# EAGLE schematic Mac_Project_sch_With_Resistors (EAGLE 9.1.3)
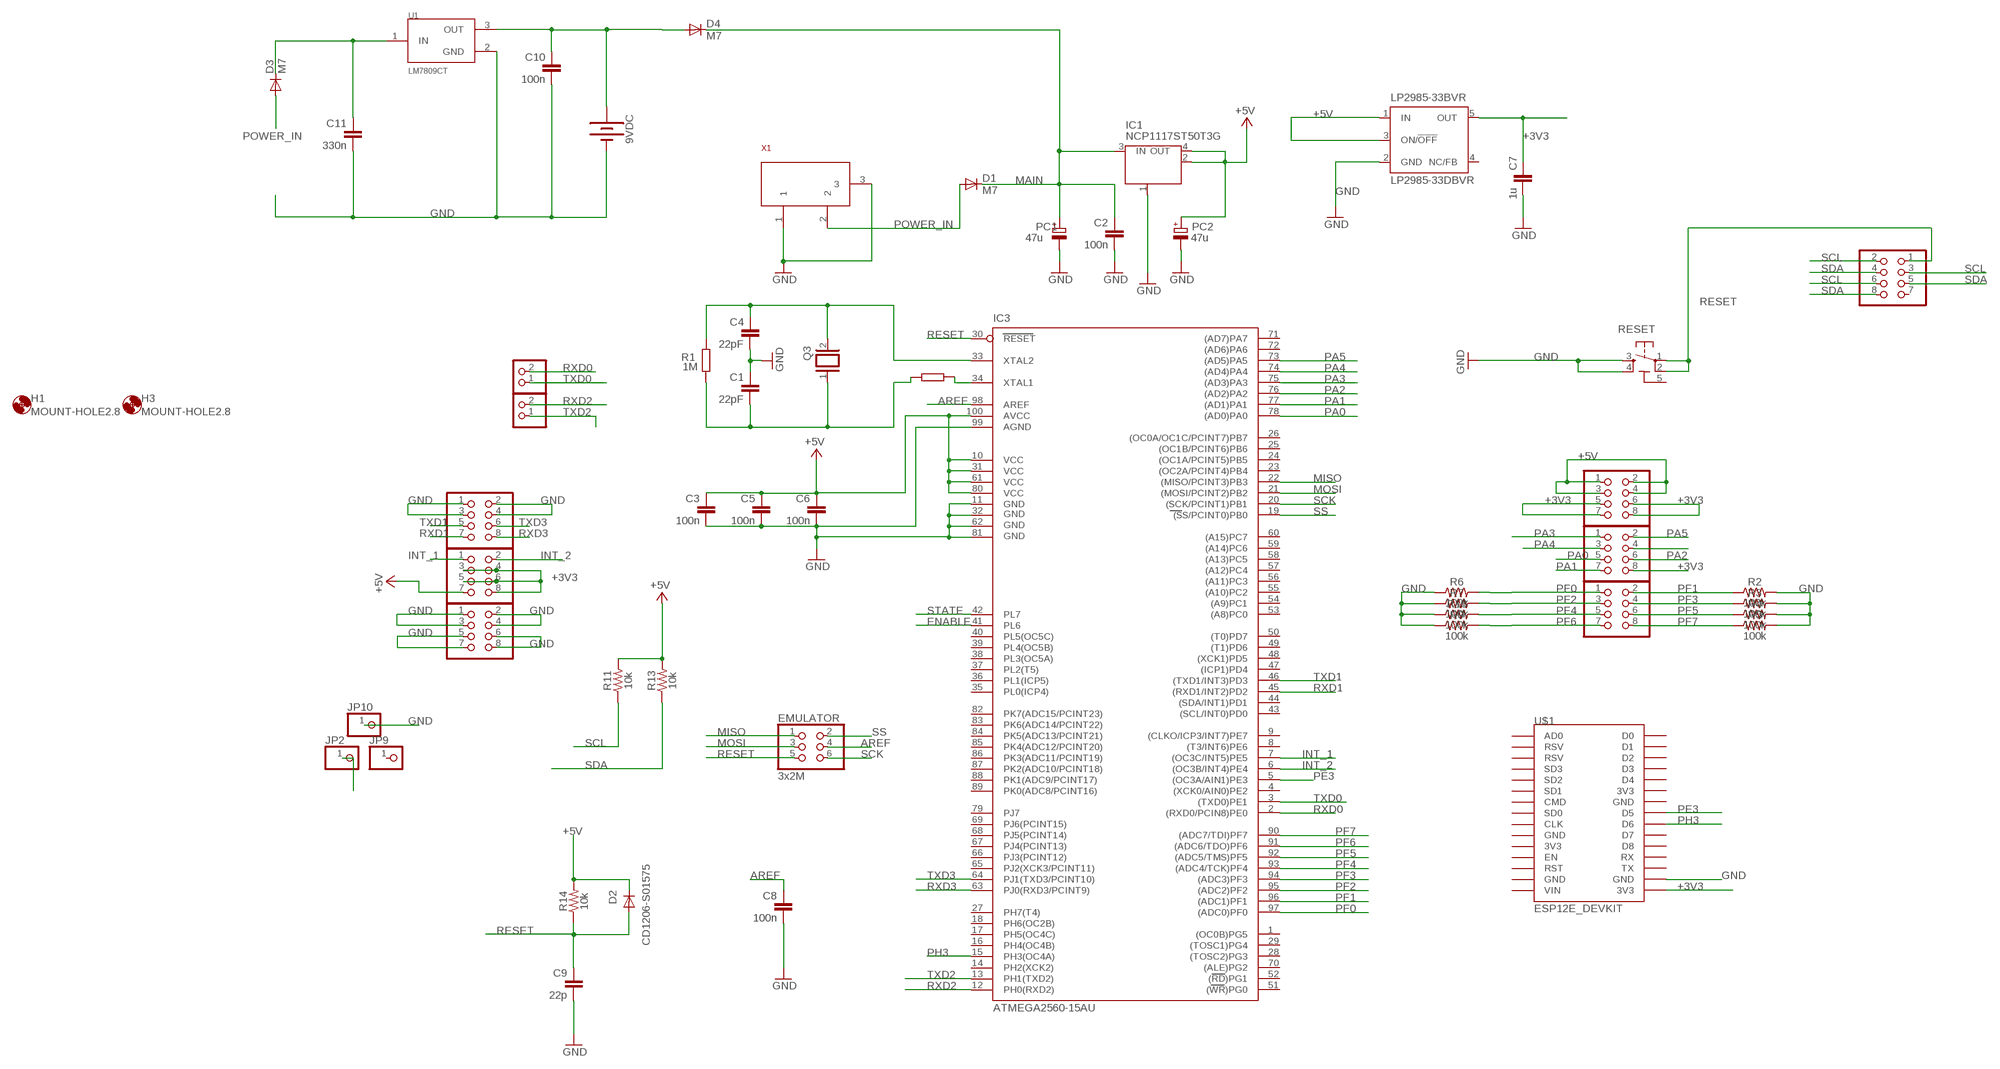
[diagram p0: schematic, sheet 1]

## Parts
1X1  1x2  PINHD-1X2  [1X02]
1X2  1x2  PINHD-1X2  [1X02]
9VDC  BATTERY-9V  [BATTCON_9V]
C1  22pF  C-EU0603-RND  [C0603-ROUND]
C2  100n  C-EU0603-RND  [C0603-ROUND]
C3  100n  C-EU0603-RND  [C0603-ROUND]
C4  22pF  C-EU0603-RND  [C0603-ROUND]
C5  100n  C-EU0603-RND  [C0603-ROUND]
C6  100n  C-EU0603-RND  [C0603-ROUND]
C7  1u  C-EU0603-RND  [C0603-ROUND]
C8  100n  C-EU0603-RND  [C0603-ROUND]
C9  22p  C-EU0603-RND  [C0603-ROUND]
C10  100n  C-EU0603-RND  [C0603-ROUND]
C11  330n  C-EU0603-RND  [C0603-ROUND]
D1  M7  DIODE-SMB  [SMB]
D2  CD1206-S01575  DIODE-MINIMELF  [MINIMELF]
D3  M7  DIODE-SMB  [SMB]
D4  M7  DIODE-SMB  [SMB]
EMULATOR  3x2M  PINHD-2X3  [2X03]
H1  MOUNT-HOLE2.8  [2,8]
H3  MOUNT-HOLE2.8  [2,8]
IC1  NCP1117ST50T3G  MC33269ST-3.3T3  [SOT223]
IC3  ATMEGA2560-15AU  0023_ATMEGA2560-16AU  [TQFP100]
JP1  PINHD-2X4  [2X04]
JP2  PINHD-1X1  [1X01]
JP3  PINHD-2X4  [2X04]
JP4  PINHD-2X4  [2X04]
JP5  PINHD-2X4  [2X04]
JP6  PINHD-2X4  [2X04]
JP7  PINHD-2X4  [2X04]
JP8  PINHD-2X4  [2X04]
JP9  PINHD-1X1  [1X01]
JP10  PINHD-1X1  [1X01]
LP2985-33BVR  LP2985-33DBVR  LP2985-XXDBVR33  [SOT23-DBV]
PC1  47u  CPOL-EUD  [PANASONIC_D]
PC2  47u  CPOL-EUD  [PANASONIC_D]
Q3  16MHz  XTAL/S  [QS]
R1  1M  R-EU_R0603  [R0603-ROUND]
R2  100k  100KOHM-0603-1/10W-1%  [0603]
R3  100k  100KOHM-0603-1/10W-1%  [0603]
R4  100k  100KOHM-0603-1/10W-1%  [0603]
R5  100k  100KOHM-0603-1/10W-1%  [0603]
R6  100k  100KOHM-0603-1/10W-1%  [0603]
R7  100k  100KOHM-0603-1/10W-1%  [0603]
R9  100k  100KOHM-0603-1/10W-1%  [0603]
R10  100k  100KOHM-0603-1/10W-1%  [0603]
R11  10k  10KOHM-0603-1/10W-1%  [0603]
R12  27O  R-EU_R0603  [R0603-ROUND]
R13  10k  10KOHM-0603-1/10W-1%  [0603]
R14  10k  10KOHM-0603-1/10W-1%  [0603]
RESET  TS42  [TS42]
U1  LM7809CT  [TO254P470X1016X1879-3P]
U$1  ESP12E_DEVKIT  [ESP12E_DEVKIT]
X1  POWERSUPPLY_DC21MMX  [POWERSUPPLY_DC-21MM]

## Nets
+3V3: C7.2 JP3.5 JP3.6 JP3.7 JP3.8 JP4.8 JP7.3 JP7.4 JP7.5 JP7.6 JP7.8 LP2985-33BVR.5(OUT) U$1.3V3@2(3V3)
+5V: C3.1 C5.1 C6.1 D2.C IC1.2(OUT) IC1.4(OUT) IC3.10(VCC) IC3.31(VCC1) IC3.61(VCC2) IC3.80(VCC3) IC3.100(AVCC) JP3.1 JP3.2 JP3.3 JP3.4 JP7.7 LP2985-33BVR.1(IN) LP2985-33BVR.3(ON/!OFF) PC2.+ R11.2 R13.2 R14.2
AREF: C8.1 EMULATOR.4 IC3.98(AREF)
ENABLE: IC3.41(PL6)
GND: 9VDC.- C1.1 C2.2 C3.2 C4.2 C5.2 C6.2 C7.1 C8.2 C9.2 C10.2 C11.2 IC1.1(GND/ADJ) IC3.11(GND) IC3.32(GND1) IC3.62(GND2) IC3.81(GND3) IC3.99(AGND) JP1.1 JP1.2 JP1.3 JP1.4 JP1.5 JP1.6 JP1.7 JP1.8 JP4.4 JP6.1 JP6.2 JP6.3 JP6.4 JP10.1 LP2985-33BVR.2(GND) PC1.- PC2.- R2.2 R3.2 R4.2 R5.2 R6.1 R7.1 R9.1 R10.1 RESET.3 RESET.4 U1.2(GND) U$1.GND@3(GND) X1.1 X1.3
INT_1: IC3.7((OC3C/INT5)PE5) JP7.1
INT_2: IC3.6((OC3B/INT4)PE4) JP7.2
MAIN: C2.1 D1.C D4.C IC1.3(IN) PC1.+
MISO: EMULATOR.1 IC3.22((MISO/PCINT3)PB3)
MOSI: EMULATOR.3 IC3.21((MOSI/PCINT2)PB2)
N$1: C4.1 IC3.33(XTAL2) Q3.2 R1.2
N$2: C1.2 Q3.1 R1.1 R12.1
N$3: IC3.34(XTAL1) R12.2
N$6: JP2.1
N$13: C11.1 D3.C U1.1(IN)
N$15: 9VDC.+ C10.1 D4.A U1.3(OUT)
PA0: IC3.78((AD0)PA0) JP4.5
PA1: IC3.77((AD1)PA1) JP4.7
PA2: IC3.76((AD2)PA2) JP4.6
PA3: IC3.75((AD3)PA3) JP4.1
PA4: IC3.74((AD4)PA4) JP4.3
PA5: IC3.73((AD5)PA5) JP4.2
PE3: IC3.5((OC3A/AIN1)PE3) U$1.D5
PF0: IC3.97((ADC0)PF0) JP8.1 R6.2
PF1: IC3.96((ADC1)PF1) JP8.2 R2.1
PF2: IC3.95((ADC2)PF2) JP8.3 R7.2
PF3: IC3.94((ADC3)PF3) JP8.4 R3.1
PF4: IC3.93((ADC4/TCK)PF4) JP8.5 R10.2
PF5: IC3.92((ADC5/TMS)PF5) JP8.6 R4.1
PF6: IC3.91((ADC6/TDO)PF6) JP8.7 R9.2
PF7: IC3.90((ADC7/TDI)PF7) JP8.8 R5.1
PH3: IC3.15(PH3(OC4A)) U$1.D6
POWER_IN: D1.A D3.A X1.2
RESET: C9.1 D2.A EMULATOR.5 IC3.30(RESET) JP5.1 R14.1 RESET.1 RESET.2
RXD0: 1X2.2 IC3.2((RXD0/PCIN8)PE0)
RXD1: IC3.45((RXD1/INT2)PD2) JP6.7
RXD2: 1X1.2 IC3.12(PH0(RXD2))
RXD3: IC3.63(PJ0(RXD3/PCINT9)) JP6.8
SCK: EMULATOR.6 IC3.20((SCK/PCINT1)PB1)
SCL: JP5.2 JP5.3 JP5.6 R11.1
SDA: JP5.4 JP5.5 JP5.8 R13.1
SS: EMULATOR.2 IC3.19((SS/PCINT0)PB0)
STATE: IC3.42(PL7)
TXD0: 1X2.1 IC3.3((TXD0)PE1)
TXD1: IC3.46((TXD1/INT3)PD3) JP6.5
TXD2: 1X1.1 IC3.13(PH1(TXD2))
TXD3: IC3.64(PJ1(TXD3/PCINT10)) JP6.6
Unconnected: IC3.1((OC0B)PG5) IC3.4((XCK0/AIN0)PE2) IC3.8((T3/INT6)PE6) IC3.9((CLKO/ICP3/INT7)PE7) IC3.14(PH2(XCK2)) IC3.16(PH4(OC4B)) IC3.17(PH5(OC4C)) IC3.18(PH6(OC2B)) IC3.23((OC2A/PCINT4)PB4) IC3.24((OC1A/PCINT5)PB5) IC3.25((OC1B/PCINT6)PB6) IC3.26((OC0A/OC1C/PCINT7)PB7) IC3.27(PH7(T4)) IC3.28((TOSC2)PG3) IC3.29((TOSC1)PG4) IC3.35(PL0(ICP4)) IC3.36(PL1(ICP5)) IC3.37(PL2(T5)) IC3.38(PL3(OC5A)) IC3.39(PL4(OC5B)) IC3.40(PL5(OC5C)) IC3.43((SCL/INT0)PD0) IC3.44((SDA/INT1)PD1) IC3.47((ICP1)PD4) IC3.48((XCK1)PD5) IC3.49((T1)PD6) IC3.50((T0)PD7) IC3.51((WR)PG0) IC3.52((RD)PG1) IC3.53((A8)PC0) IC3.54((A9)PC1) IC3.55((A10)PC2) IC3.56((A11)PC3) IC3.57((A12)PC4) IC3.58((A13)PC5) IC3.59((A14)PC6) IC3.60((A15)PC7) IC3.65(PJ2(XCK3/PCINT11)) IC3.66(PJ3(PCINT12)) IC3.67(PJ4(PCINT13)) IC3.68(PJ5(PCINT14)) IC3.69(PJ6(PCINT15)) IC3.70((ALE)PG2) IC3.71((AD7)PA7) IC3.72((AD6)PA6) IC3.79(PJ7) IC3.82(PK7(ADC15/PCINT23)) IC3.83(PK6(ADC14/PCINT22)) IC3.84(PK5(ADC13/PCINT21)) IC3.85(PK4(ADC12/PCINT20)) IC3.86(PK3(ADC11/PCINT19)) IC3.87(PK2(ADC10/PCINT18)) IC3.88(PK1(ADC9/PCINT17)) IC3.89(PK0(ADC8/PCINT16)) JP5.7 JP9.1 LP2985-33BVR.4(NC/FB) U$1.3V3@0(3V3) U$1.3V3@1(3V3) U$1.AD0 U$1.CLK U$1.CMD U$1.D0 U$1.D1 U$1.D2 U$1.D3 U$1.D4 U$1.D7 U$1.D8 U$1.EN U$1.GND@0(GND) U$1.GND@1(GND) U$1.GND@2(GND) U$1.RST U$1.RSV@0(RSV) U$1.RSV@1(RSV) U$1.RX U$1.SD0 U$1.SD1 U$1.SD2 U$1.SD3 U$1.TX U$1.VIN

## Power pins joined to a net without a drawn wire
5-GND: RESET.5(5-GND)

## Library data of the parts
1X1 1X2 = pinhead:PINHD-1X2: PIN HEADER
9VDC = SparkFun-Batteries:BATTERY: Battery - Single Cell A variety of battery chemistries, sizes, and footprints. Device List: 20MM_PTH - Coin Cell Battery Holder - 20mm (PTH) <https://www.sparkfun.com/products/783> 20MM_PTH_KIT- Coin Cell battery Holder - 20 mm (PTH) <http://www.sparkfun.com/products/783>kit version with special mask 6.8MM_PTH - Coin Cell Battery Holder - 6.8MM(SMD) <https://www.digikey.com/product-detail/en/seiko-instruments/MS621FE-FL11E/728-1057-ND/1889208?WT.srch=1&gclid=CNOQ5a6LzdQCFZS2wAodXCkE0g> 12MM_SMD - Coin Cell Battery Holder - 12mm (SMD) <https://www.sparkfun.com/products/10592> 12MM_PTH - Coin Cell Battery Holder - 12mm (PTH) <https://www.sparkfun.com/products/7948> 20MM_SMD - 20mm Coin Cell Battery Holder (SMD) (2 legs) Used on the Big Time Watch Kit <https://www.sparkfun.com/products/11734> 20MM_SMD_4LEGS - Coin Cell Battery Holder - 20mm (SMD) <https://www.sparkfun.com/products/11892> 20MM_SMD_4LEGS_OVERPASTE - Coin Cell Battery Holder - 20mm (SMD) <https://www.sparkfun.com/products/11892> (Over-paste on the legs) 24.5MM_PTH - Coin Cell Battery Holder - 24.5mm (PTH) <https://www.sparkfun.com/products/8863> 9V - 9V Battery Holder - PC Mount Used on the SparkFun SparkPunk Sound Kit <https://www.sparkfun.com/products/11177> and SparkFun SparkPunk Sequencer Kit <https://www.sparkfun.com/products/12707> 18650 - Battery Holder - 18650 (PTH) <https://www.sparkfun.com/products/13113> AA - Battery Holder - 1xAA (PTH) <https://www.sparkfun.com/products/7949> AAA - Battery Holder - 1xAAA (PTH) <https://www.sparkfun.com/products/12718> AA_KIT - Battery Holder - 1xAA (PTH) <https://www.sparkfun.com/products/7949> Special kit package - pads only have exposed copper on one side of the board. AAA_KIT - Battery Holder - 1xAAA (PTH) <https://www.sparkfun.com/products/12718> Special kit package - pads only have exposed copper on one side of the board.; PROD_ID: BATT-10855
C1-C11 = SmartPrj:C-EU: CAPACITOR, European symbol
D1-D4 = diode:DIODE-: DIODE
EMULATOR = SmartPrj:PINHD-2X3: PIN HEADER
H1 H3 = holes:MOUNT-HOLE: MOUNTING HOLE with drill center marker
IC1 = linear:MC33269ST*: Adjustable Output Low Dropout Voltage Regulator 800 mA Source: http://www.onsemi.com/pub/Collateral/MC33269-D.PDF
IC3 = IntegratedCircuits:0023_ATMEGA2560-16AU: 8-bit Microcontroller with 256K Bytes In-System Programmable Flash - ATMEGA2560-16AU; CASE: TQFP100_14x14; MONTHLY_USAGE: _____; PART_NUMBER: ATMEGA2560-16AU; PRICE: _____; SUPPLIER: _____; TYPE: Circuito_Integrato
JP1 JP3-JP8 = adafruit:PINHD-2X4: PIN HEADER
JP2 JP9 JP10 = pinhead:PINHD-1X1: PIN HEADER
LP2985-33BVR = SmartPrj:LP2985-XXDBVR: ULTRALOW-POWER 50-mA LOW-DROPOUT LINEAR REGULATORS 50-mA Low-Dropout Regulator Source: http://focus.ti.com/lit/ds/symlink/tps77001.pdf
PC1 PC2 = rcl:CPOL-EU: POLARIZED CAPACITOR, European symbol
Q3 = special:XTAL/S: CRYSTAL
R1 R12 = SmartPrj:R-EU_: RESISTOR, European symbol
R2-R7 R9 R10 = SparkFun-Resistors:100KOHM: 100kΩ resistor A resistor is a passive two-terminal electrical component that implements electrical resistance as a circuit element. Resistors act to reduce current flow, and, at the same time, act to lower voltage levels within circuits. - Wikipedia; PROD_ID: RES-07828
R11 R13 R14 = SparkFun-Resistors:10KOHM: 10kΩ resistor A resistor is a passive two-terminal electrical component that implements electrical resistance as a circuit element. Resistors act to reduce current flow, and, at the same time, act to lower voltage levels within circuits. - Wikipedia; PROD_ID: RES-00824
RESET = SmartPrj:TS42: TS42 Dongnan Electronics Tact switch VDC 12V - 50mA
U1 = LM7809CT:LM7809CT: Standard Regulator Pos 9V 1A 3-Pin(3+Tab) TO-220AB Rail; AVAILABILITY: Unavailable; DESCRIPTION: Standard Regulator Pos 9V 2.2A 3-Pin_3+Tab_ TO-220AB Rail; MF: ON Semiconductor; MP: LM7809CT; PACKAGE: TO-220 ON Semiconductor; PRICE: None
U$1 = ESP12E_DEVKIT:ESP12E_DEVKIT: ESP12E DEVKIT BOARD
X1 = SmartPrj:POWERSUPPLY_DC21MM